# Altium schematic sheet MCU.SchDoc
size A4
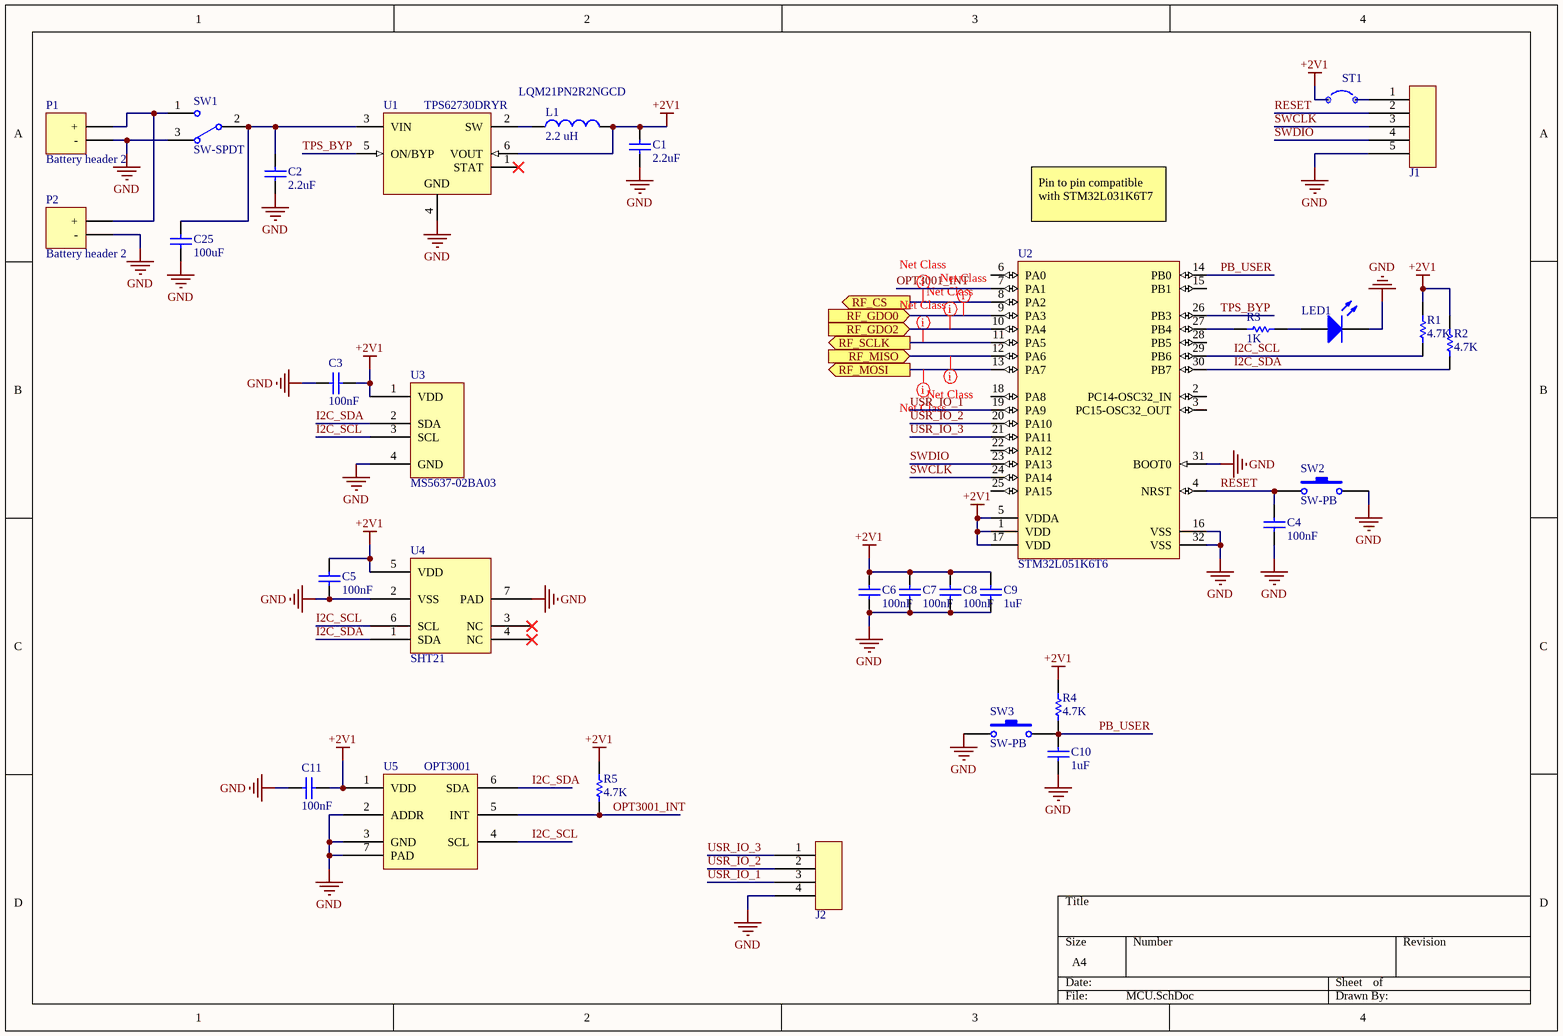
[diagram p0: MCU.SchDoc]

## Parts
C1  value 2.2uF  [0402_ipc]  (hidden comment: Cap)
C2  value 2.2uF  [0402_ipc]  (hidden comment: Cap)
C3  value 100nF  [0402_ipc]  (hidden comment: Cap)
C4  value 100nF  [0402_ipc]  (hidden comment: Cap)
C5  value 100nF  [0402_ipc]  (hidden comment: Cap)
C6  value 100nF  [0402_ipc]  (hidden comment: Cap)
C7  value 100nF  [0402_ipc]  (hidden comment: Cap)
C8  value 100nF  [0402_ipc]  (hidden comment: Cap)
C9  value 1uF  [0402_ipc]  (hidden comment: Cap)
C10  value 1uF  [0402_ipc]  (hidden comment: Cap)
C11  value 100nF  [0402_ipc]  (hidden comment: Cap)
C25  value 100uF  [1206_IPC]  (hidden comment: Cap)
J1  CONN_5  [MOLEX_5_1.27]  (value not drawn)
J2  CONN_4  [HDR1X4_100mil]  (value not drawn)
L1  value 2.2 uH  PartNumber: LQM21PN2R2NGCD  [0805_IPC]  (hidden comment: Inductor)
LED1  LED  [0805_IPC]  (value not drawn)
P1  Battery header 2  [HDR1X2_100mil]
P2  Battery header 2  [SMTU2450N-LF]
R1  value 4.7K  [0402_ipc]  (hidden comment: Res)
R2  value 4.7K  [0402_ipc]  (hidden comment: Res)
R3  value 1K  [0402_ipc]  (hidden comment: Res)
R4  value 4.7K  [0402_ipc]  (hidden comment: Res)
R5  value 4.7K  [0402_ipc]  (hidden comment: Res)
ST1  STRAP  [STRAP]  (value not drawn)
SW1  SW-SPDT  [PCM12SMTR]
SW2  SW-PB  [B3U-1000P]
SW3  SW-PB  [MCDTS-2]
U1  TPS62730DRYR  [DRY6]
U2  STM32L051K6T6  [STM-LQFP32_L]
U3  MS5637-02BA03  [MS5637-02BA03]
U4  SHT21  [SHT21]
U5  OPT3001  [OPT3001]

## Ports
RF_CS (out), RF_GDO0 (in), RF_GDO2 (in), RF_MISO (in), RF_MOSI (out), RF_SCLK (out)

## Nets
+2V1: C1.2 C3.1 C5.1 C6.2 C7.2 C8.2 C9.2 C11.2 L1.2 R1.2 R2.2 R4.2 R5.2 ST1.1 U1.6(VOUT) U2.1(VDD) U2.5(VDDA) U2.17(VDD) U3.1(VDD) U4.5(VDD) U5.1(VDD)
GND: C1.1 C2.1 C3.2 C4.1 C5.2 C6.1 C7.1 C8.1 C9.1 C10.1 C11.1 C25.1 J1.5 J2.4 LED1.2(K) P1.2(-) P2.2(-) SW1.3 SW2.2 SW3.1 U1.4(GND) U2.16(VSS) U2.31(BOOT0) U2.32(VSS) U3.4(GND) U4.2(VSS) U4.7(PAD) U5.2(ADDR) U5.3(GND) U5.7(PAD)
I2C_SCL: R1.1 U2.29(PB6) U3.3(SCL) U4.6(SCL) U5.4(SCL)
I2C_SDA: R2.1 U2.30(PB7) U3.2(SDA) U4.1(SDA) U5.6(SDA)
OPT3001_INT: R5.1 U2.7(PA1) U5.5(INT)
PB_USER: C10.2 R4.1 SW3.2 U2.14(PB0)
RESET: C4.2 J1.2 SW2.1 U2.4(NRST)
RF_CS: U2.8(PA2) ; port RF_CS
RF_GDO0: U2.9(PA3) ; port RF_GDO0
RF_GDO2: U2.10(PA4) ; port RF_GDO2
RF_MISO: U2.12(PA6) ; port RF_MISO
RF_MOSI: U2.13(PA7) ; port RF_MOSI
RF_SCLK: U2.11(PA5) ; port RF_SCLK
SWCLK: J1.3 U2.24(PA14)
SWDIO: J1.4 U2.23(PA13)
TPS_BYP: U1.5(ON/BYP) U2.26(PB3)
USR_IO_1: J2.3 U2.19(PA9)
USR_IO_2: J2.2 U2.20(PA10)
USR_IO_3: J2.1 U2.21(PA11)
NetC2_2: C2.2 C25.2 SW1.2 U1.3(VIN)
NetJ1_1: J1.1 ST1.2
NetL1_1: L1.1 U1.2(SW)
NetLED1_1: LED1.1(A) R3.2
NetP1_1: P1.1(+) P2.1(+) SW1.1
NetR3_1: R3.1 U2.27(PB4)

Not connected (* = marked no-connect by the designer): U1 1(STAT)*; U2 2(PC14-OSC32_IN) 3(PC15-OSC32_OUT) 6(PA0) 15(PB1) 18(PA8) 22(PA12) 25(PA15) 28(PB5); U4 3(NC)* 4(NC)*

## Layout directives
net class SPI: RF_CS, RF_GDO0, RF_GDO2, RF_MISO, RF_MOSI, RF_SCLK

## Notes on the sheet
- Pin to pin compatible with STM32L031K6T7

## Library data of the parts
C1 C2 = Cap: Capacitor; PartNumber: GRM155R60J225ME95D; PackageReference: RAD-0.3; Publisher: Altium Limited; Farnell: 2362091
C3-C8 C11 = Cap: Capacitor; PartNumber: GRM155R71C104KA88D; PackageReference: RAD-0.3; Publisher: Altium Limited; Farnell: 8819742
C9 C10 = Cap: Capacitor; PartNumber: GRM155R61C105KA12D; PackageReference: RAD-0.3; Publisher: Altium Limited; Farnell: 2362093
C25 = Cap: Capacitor; PartNumber: GRM31CR60J157ME11L; PackageReference: RAD-0.3; Publisher: Altium Limited; Farnell: 2494474
J1 = CONN_5: 5 pin connector; PartNumber: 53048-0510; Reference: molex_530480510_sd; Farnell: 9732926
J2 = CONN_4: 4 pin connector; PartNumber: Pin Header; Reference: *
LED1 = LED: Reference: SML-H12M8TT86; PartNumber: SML-H12M8TT86; Farnell: 2507536
P1 = Battery header 2: PartNumber: Pin Header; LatestRevisionDate: 17-Jul-2002; LatestRevisionNote: Re-released for DXP Platform.; Publisher: Altium Limited
P2 = Battery header 2: PartNumber: SMTU 2450N-1-LF; LatestRevisionDate: 17-Jul-2002; LatestRevisionNote: Re-released for DXP Platform.; Publisher: Altium Limited; Farnell: 1216356
R1 R2 R4 R5 = Res: Resistor; PartNumber: ERJ2GEJ472X; Farnell: 2059234
R3 = Res: Resistor; PartNumber: MC00625W040211K; Farnell: 1358043
SW1 = SW-SPDT: SPDT Switch; PartNumber: PCM12SMTR; Farnell: 9575146
SW2 = SW-PB: Tactile Switch; Reference: B3U-1000P; PartNumber: B3U-1000P; Farnell: 1333652
SW3 = SW-PB: Tactile Switch; PartNumber: MCDTS2-4N; Reference: *; Farnell: 9471634
U1 = TPS62730DRYR: Buck Step Down Regulator with 1.9 to 3.9 V Input and 2.1 V Output, -40 to 85 degC, 6-Pin SON (DRY), Green (RoHS & no Sb/Br); Manufacturer: Texas Instruments; PartNumber: TPS62730DRYT; Duty Cycle(Max)(%): 100; Iout(Max)(A): 0.1; Rating: Catalog; Regulated Outputs(#): 1; SubFamily: Step-Down Regulator; Synchronous Rectification: TRUE; Vin(Max)(V): 3.9; Vin(Min)(V): 1.9; Vout(Max)(V): 2.1; DatasheetVersion: SLVSAC3A; PackageVersion: revF, Dec-2011; PackageReference: DRY6; PackageDescription: 6-Pin Plastic Small Outline No-Lead, 1 x 1.45 x 0.6 mm Body, 0.5 mm Pitch; Supplier 1: Digi-Key; Supplier Part Number 1: TPS62730DRYR-ND; Supplier 2: Newark; Supplier Part Number 2: 52T8813; Supplier 3: Mouser; Supplier Part Number 3: 595-TPS62730DRYR; Eco-Plan: Green (RoHS & no Sb/Br); Topology: Buck; Vout(Min)(V): 2.1; Mounting Technology: Surface Mount; ComponentLink1Description: Datasheet; ComponentLink1URL: http://www.ti.com/general/docs/lit/getliterature.tsp?genericPartNumber=TPS62730&fileType=pdf; ComponentLink2Description: Package Specification; ComponentLink2URL: http://www.ti.com/litv/pdf/mpds221e; ComponentLink3Description: URL Link1; ComponentLink3URL: Samples URL:http://www.ti.com/product/tps62730#samples; Farnell: 1961827
U2 = CMP-1341-00001-1: Access Line Ultra-Low-Power ADC, 32 Bit MCU ARM, 32 kB Flash, 8 kB SRAM, 2 kB EEPROM, -40 to 85 degC, 32-Pin LQFP, Tray; PartNumber: STM32L031K6T7; Manufacturer: STMicroelectronics; RAM: 8 kB; Comparators: 2; Data EEPROM: 2 kB; GPIOs: 25; Flash: 32 kB; Temperature Range: -40 to 85 degC; ComponentLink1Description: Manufacturer URL; Packing: Tray; DatasheetVersion: Rev. 4; ComponentLink3URL: http://www.st.com/st-web-ui/static/active/en/resource/technical/document/datasheet/DM00108219.pdf; ComponentLink1URL: http://www.st.com/; ComponentLink2URL: http://www.st.com/st-web-ui/static/active/en/resource/technical/document/datasheet/DM00108219.pdf; ComponentLink2Description: Datasheet; PackageDescription: 32-Pin Low-Profile Quad Flat Package, Body 7 x 7 mm, Pitch 0.8 mm; ComponentLink3Description: Package Specification; Mounting Technology: Surface Mount; Farnell: 2535503
U3 = MS5637-02BA03: Low Voltage Barometric Pressure Sensor; PartNumber: MS563702BA03-50; Farnell: 2362663
U4 = SHT21: Humidity and Temperature Sensor; PartNumber: SHT21; Farnell: 1855468
U5 = OPT3001: Light sensor; PartNumber: OPT3001DNPT; Farnell: 2466963
L1 = Inductor: Farnell: 2470293